# EAGLE design ch340g_3.3v (EAGLE 7.7.0)
CNAME: CH340G USB Serial Adapter 3.3V; CREVISION: 0.1; DESIGNER: drubicza
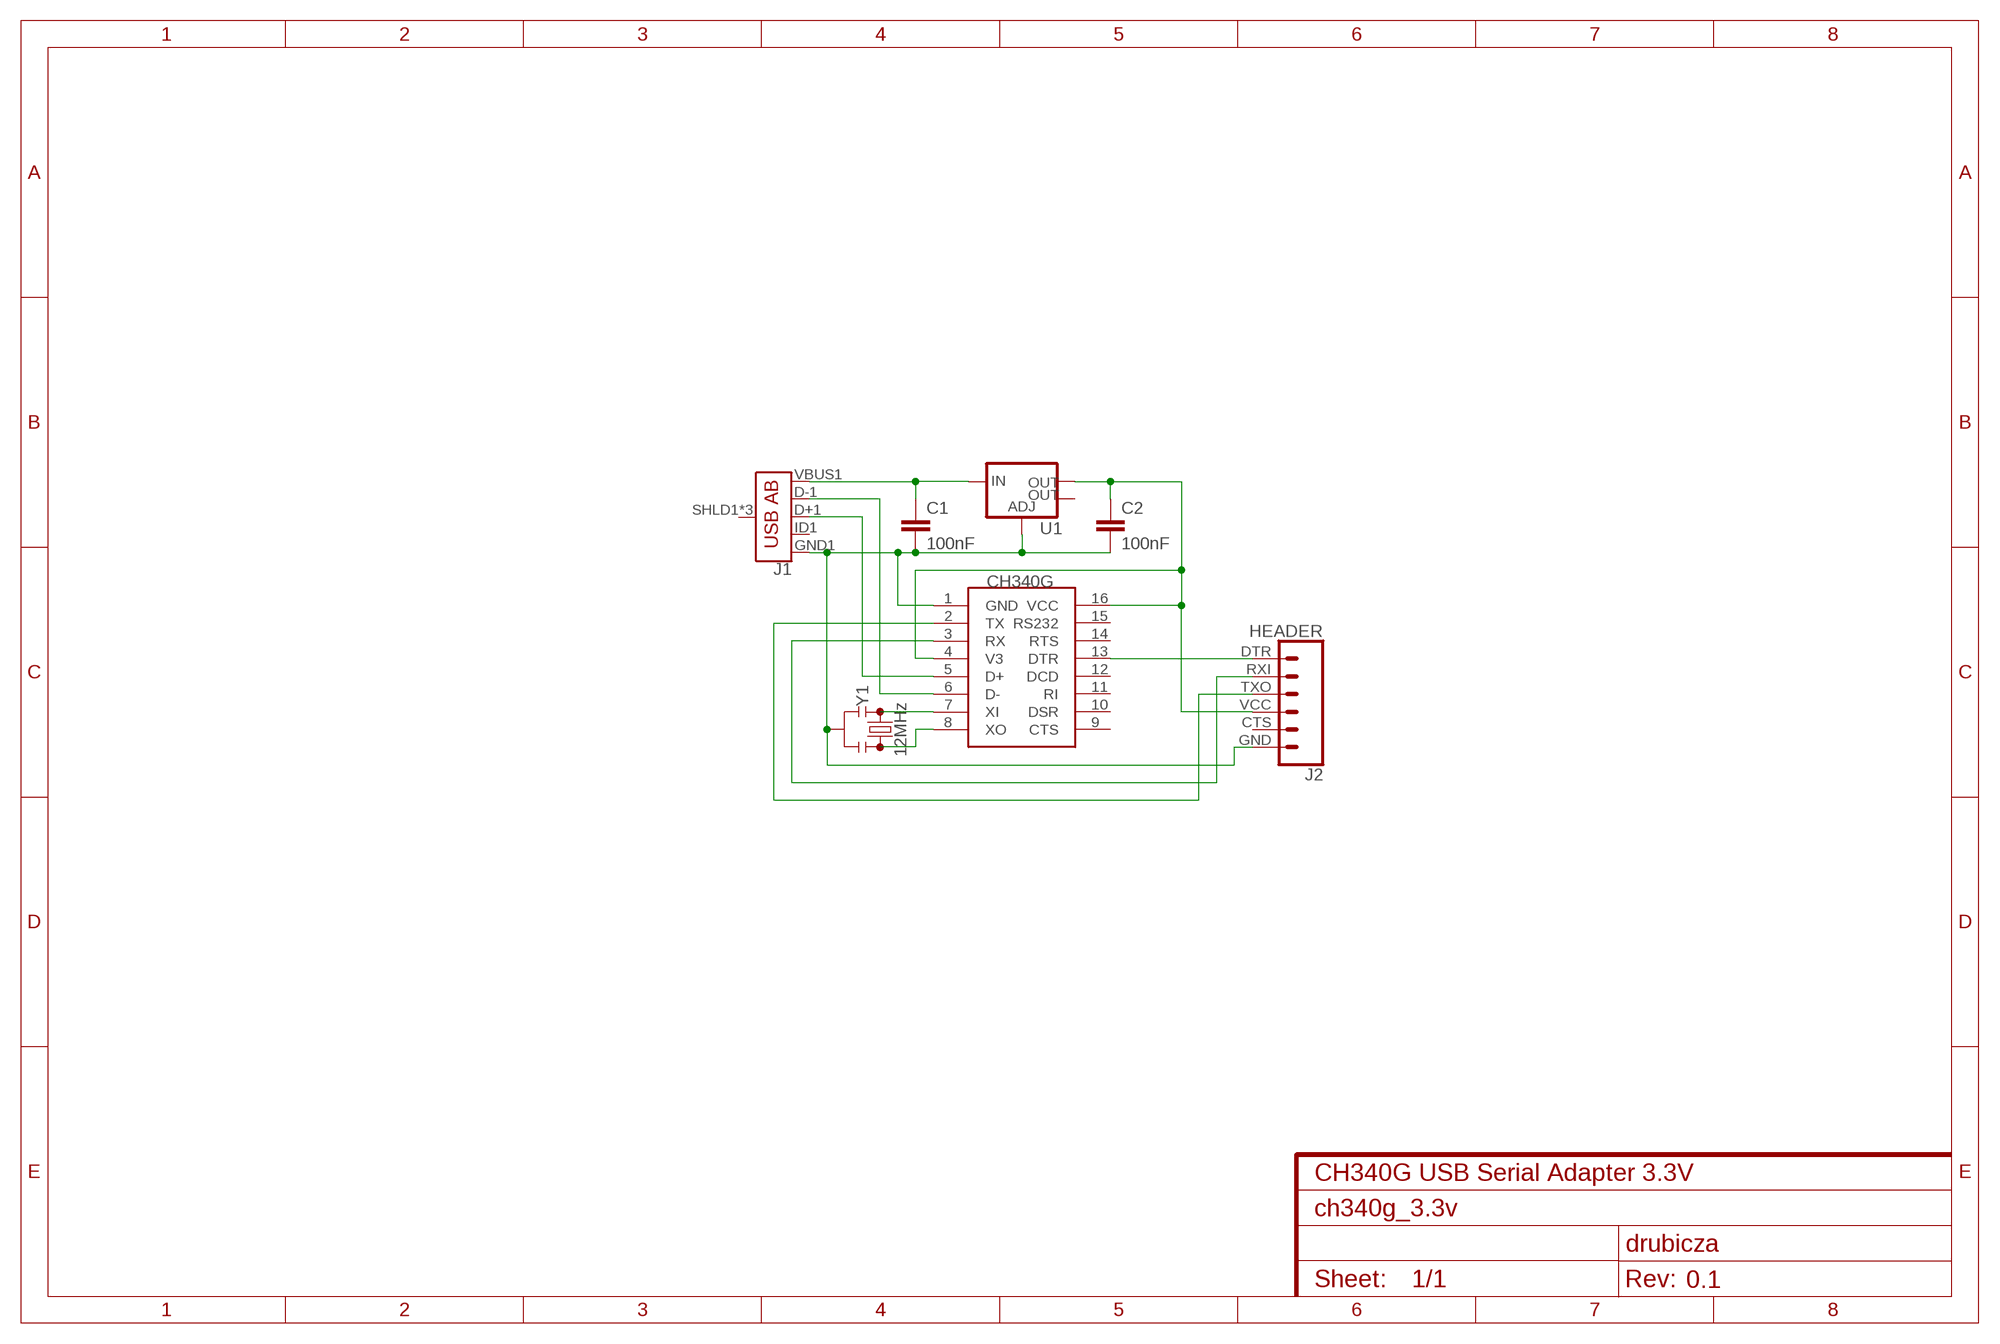
[diagram p0: schematic, sheet 1]

## Parts
C1  100nF  1.0UF-0805-25V-(+80/-20%)  [0805]
C2  100nF  1.0UF-0805-25V-(+80/-20%)  [0805]
J1  USB_AB_SMT  [USB-AB-MICRO-SMD]
J2  HEADER  6_PIN_SERIAL_CABLEPTH  [FTDI_BASIC]
U1  V_REG_LM1117SOT223  [SOT223]
U$1  CH340G  [SOIC16]
Y1  12MHz  RESONATOR-8MHZSMD_3.2X1.3  [RESONATOR-SMD-3.2X1.3]

## Nets
GND: C1.2 C2.2 J1.GND1(GND) J2.GND U1.1(ADJ) U$1.1(GND) Y1.2
N$1: U$1.7(XI) Y1.1
N$2: U$1.8(XO) Y1.3
N$3: C1.1 J1.VBUS1(VBUS) U1.3(IN)
N$4: J1.D+1(D+) U$1.5(D+)
N$5: J1.D-1(D-) U$1.6(D-)
N$6: J2.RXI U$1.3(RX)
N$7: J2.TXO U$1.2(TX)
N$8: C2.1 J2.VCC U1.2(OUT) U$1.4(V3) U$1.16(VCC)
N$10: J2.DTR U$1.13(DTR)
Unconnected: J1.ID1(USBID) J1.SHLD1(SHIELD) J1.SHLD2(SHIELD) J1.SHLD3(SHIELD) J2.CTS U1.4(OUT) U$1.9(CTS) U$1.10(DSR) U$1.11(RI) U$1.12(DCD) U$1.14(RTS) U$1.15(RS232)

## Library data of the parts
C1 C2 = SparkFun-Capacitors:1.0UF: 1µF ceramic capacitors A capacitor is a passive two-terminal electrical component used to store electrical energy temporarily in an electric field.; PROD_ID: CAP-11625; VALUE: 1.0uF
J1 = SparkFun-Connectors:USB_AB: USB Type AB Micro Connector OTG-compatible. 5 pins, 3 shield pins SparkFun Products: IOIO-OTG <https://www.sparkfun.com/products/13613> SparkFun SAMD21 Mini Breakout <https://www.sparkfun.com/products/13664>; PROD_ID: CONN-11794
J2 = SparkFun-Connectors:6_PIN_SERIAL_CABLE: 6-pin header connection for use with the "FTDI BASIC" pinout - CABLE SIDE. Also known as "Arduino Serial Program Header". This is used on a design to provide a 6-pin connection point for serial communication usually from a USB cable (D+/D-) to these headers (RX/TX). It also has the remaining pins necessary for programming in the Arduino evironment (DTR, GND, and sometimes VCC). Note, this device has "CABLE" in the name. It is intended to be used on a design that usually lives on the end of your USB cable and prvides the converter chip (FTDI232 or FTDI231x) to commnicate serial RX/TX. The "sister" device, named "TARGET" is inteneded to be used on a design that contains a target micro-controller that you wish to program. You can populate with some of these: Female Headers <https://www.sparkfun.com/products/115> (PRT-00115) For reference (or to suit your programming needs) check out these designs: SparkFun FTDI Basic Breakout - 5V <https://www.sparkfun.com/products/9716> (DEV-09716) SparkFun FTDI Basic Breakout - 3.3V <https://www.sparkfun.com/products/9873> (DEV-09873) SparkFun FTDI SmartBasic <https://www.sparkfun.com/products/12935> (DEV-12935) SparkFun Beefy 3 - FTDI Basic Breakout <https://www.sparkfun.com/products/13746> (DEV-13746)
U1 = SparkFun-IC-Power:V_REG_LM1117: Voltage Regulator LM1117 Standard adjustable voltage regulator but in SMD form. Spark Fun Electronics SKU : COM-00595; PROD_ID: VREG-08170
U$1 = usb-serial:CH340G
Y1 = SparkFun-Clocks:RESONATOR-8MHZ: 8MHz Resonator Digikey Example <http://www.digikey.com/product-detail/en/murata-electronics-north-america/CSTCE10M0G55-R0/490-1196-1-ND/584633> Frequency: 8MHz Frequency Stability: ±0.2% Frequency Tolerance: ±0.5% Capacitance: 33pF SparkFun Products Arduino Pro Mini 328- 3.3V/8MHz <https://www.sparkfun.com/products/11114> SparkFun Digital Sandbox <https://www.sparkfun.com/products/12651>; PROD_ID: XTAL-08895; VALUE: 8MHz

## Board
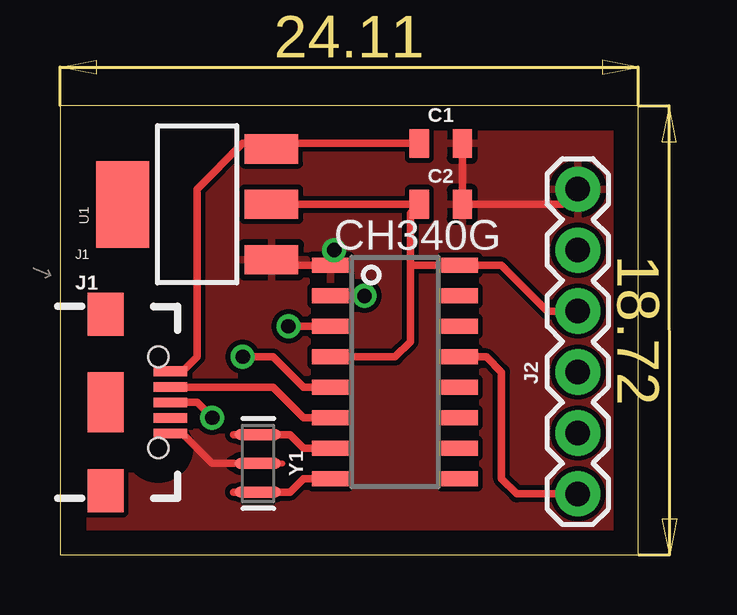
[diagram p1: board, top side]
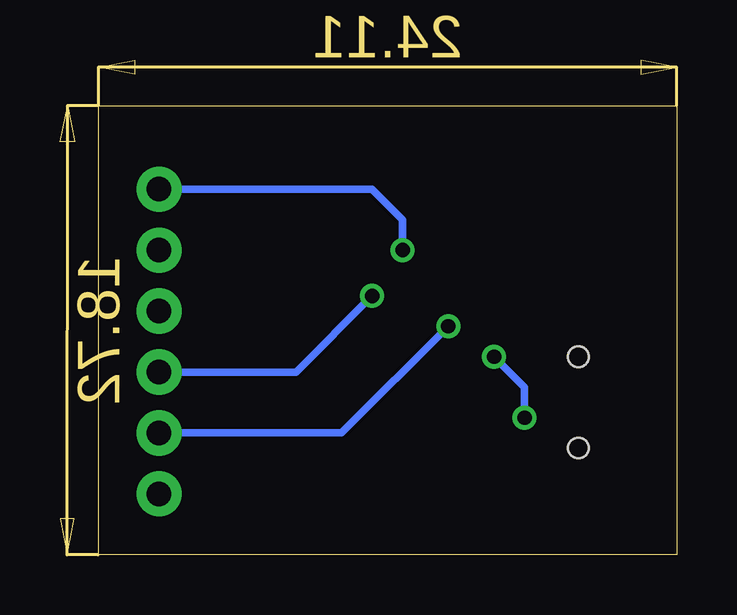
[diagram p2: board, bottom side, seen from below]

Size 24.11 x 18.72 mm. Coordinates in mm from the lower left corner, seen from the top.
Outline: 0,0 24.11,0 24.11,18.72 0,18.72 0,0
Copper layers (1*16): Top 0.035mm / dielectric 1.5mm / Bottom 0.035mm
Design rules "default": minimum track width 10mil, minimum drill 24mil, track to track 8mil, track to pad 8mil, pad to pad 8mil, via to via 8mil, smd to smd 8mil, copper to edge 40mil, drill to drill 8mil, minimum pad ring 10mil, minimum via ring 8mil, stop-mask expansion 4mil, vias tented up to drill 0mil, thermal gap 10mil

### Footprints (pad centres in the part's own frame; a part is rotated, then mirrored left to right if it is on the bottom)
0805 = smd 0.8 x 1.2: 1 -0.9,0; 2 0.9,0
USB-AB-MICRO-SMD = smd 1.4 x 0.4: D+1 2.7,0; D-1 2.7,0.65; GND1 2.7,-1.3; ID1 2.7,-0.65; VBUS1 2.7,1.3 | smd 1.5 x 1.8: SHLD1 0,-3.68; SHLD2 0,3.68 | smd 1.5 x 2.5: SHLD3 0,0 | hole 0.85: 2.2,1.9; 2.2,-1.9
FTDI_BASIC = drill 1.016 pad 1.88: CTS 10.16,0; DTR 0,0; GND 12.7,0; RXI 2.54,0; TXO 5.08,0; VCC 7.62,0
SOT223 = smd 1.219 x 2.235: 1 -2.311,-3.099; 2 0,-3.099; 3 2.311,-3.099 | smd 3.6 x 2.2: 4 0,3.099
SOIC16 = smd 0.635 x 1.524: 1 -4.445,-2.695; 2 -3.175,-2.695; 3 -1.905,-2.695; 4 -0.635,-2.695; 5 0.635,-2.695; 6 1.905,-2.695; 7 3.175,-2.695; 8 4.445,-2.695; 9 4.445,2.695; 10 3.175,2.695; 11 1.905,2.695; 12 0.635,2.695; 13 -0.635,2.695; 14 -1.905,2.695; 15 -3.175,2.695; 16 -4.445,2.695
RESONATOR-SMD-3.2X1.3 = smd 0.45 x 1.905: 1 -1.2,0; 2 0,0; 3 1.2,0

### Placement (x,y rotation side)
C1  15.88,17.14 0 top
C2  15.88,14.61 0 top
J1  1.91,6.35 0 top
J2  21.59,2.54 90 top
U1  5.71,14.61 90 top
U$1  13.97,7.62 270 top
Y1  8.26,3.81 270 top

### Tracks (layer width: path | path; a pad name or v marks a point on that pad's centre or on a via)
GND  (via drill 0.6)
  Top 0.305: U1.1 9.04,12.06 U$1.1 11.43,12.06 v11.43,12.7 | C1.2 C2.2 20.95,14.61 J2.GND | J1.GND1 5.11,5.05 6.35,3.81 7.24,3.81
  Bottom 0.305: v11.43,12.7 11.43,13.97 12.7,15.24 J2.GND
  pour Top: 1.27,17.78 1.27,0 24.13,0 24.13,17.78
N$1
  Top 0.305: 7.24,5.01 9.6,5.01 10.16,4.45 U$1.7
N$2
  Top 0.305: 7.24,2.61 9.6,2.61 10.16,3.17 U$1.8
N$3
  Top 0.305: C1.1 9.04,17.14 U1.3 8.59,17.14 7.62,17.14 5.71,15.24 5.71,8.26 5.11,7.65 J1.VBUS1
N$4  (via drill 0.6)
  Top 0.305: J1.D+1 5.71,6.35 v6.35,5.71 | v7.62,8.26 8.89,8.26 10.16,6.99 U$1.5
  Bottom 0.305: v6.35,5.71 6.35,6.99 v7.62,8.26
N$5
  Top 0.305: U$1.6 10.16,5.71 8.89,6.99 4.62,6.99 J1.D-1
N$6  (via drill 0.6)
  Top 0.305: U$1.3 v9.53,9.53
  Bottom 0.305: v9.53,9.53 13.97,5.08 J2.RXI
N$7  (via drill 0.6)
  Top 0.305: U$1.2 v12.7,10.79
  Bottom 0.305: v12.7,10.79 15.88,7.62 J2.TXO
N$8
  Top 0.305: J2.VCC 20.32,10.16 18.41,12.06 U$1.16 14.61,12.06 | U1.2 C2.1 14.61,14.23 14.61,12.06 | U$1.4 13.97,8.26 14.61,8.89 14.61,12.06
N$10
  Top 0.305: J2.DTR 19.05,2.54 18.41,3.17 18.41,7.62 17.78,8.26 U$1.13